# EAGLE schematic F2803x_Layout (EAGLE 6.4)

## Sheet 1 of 2
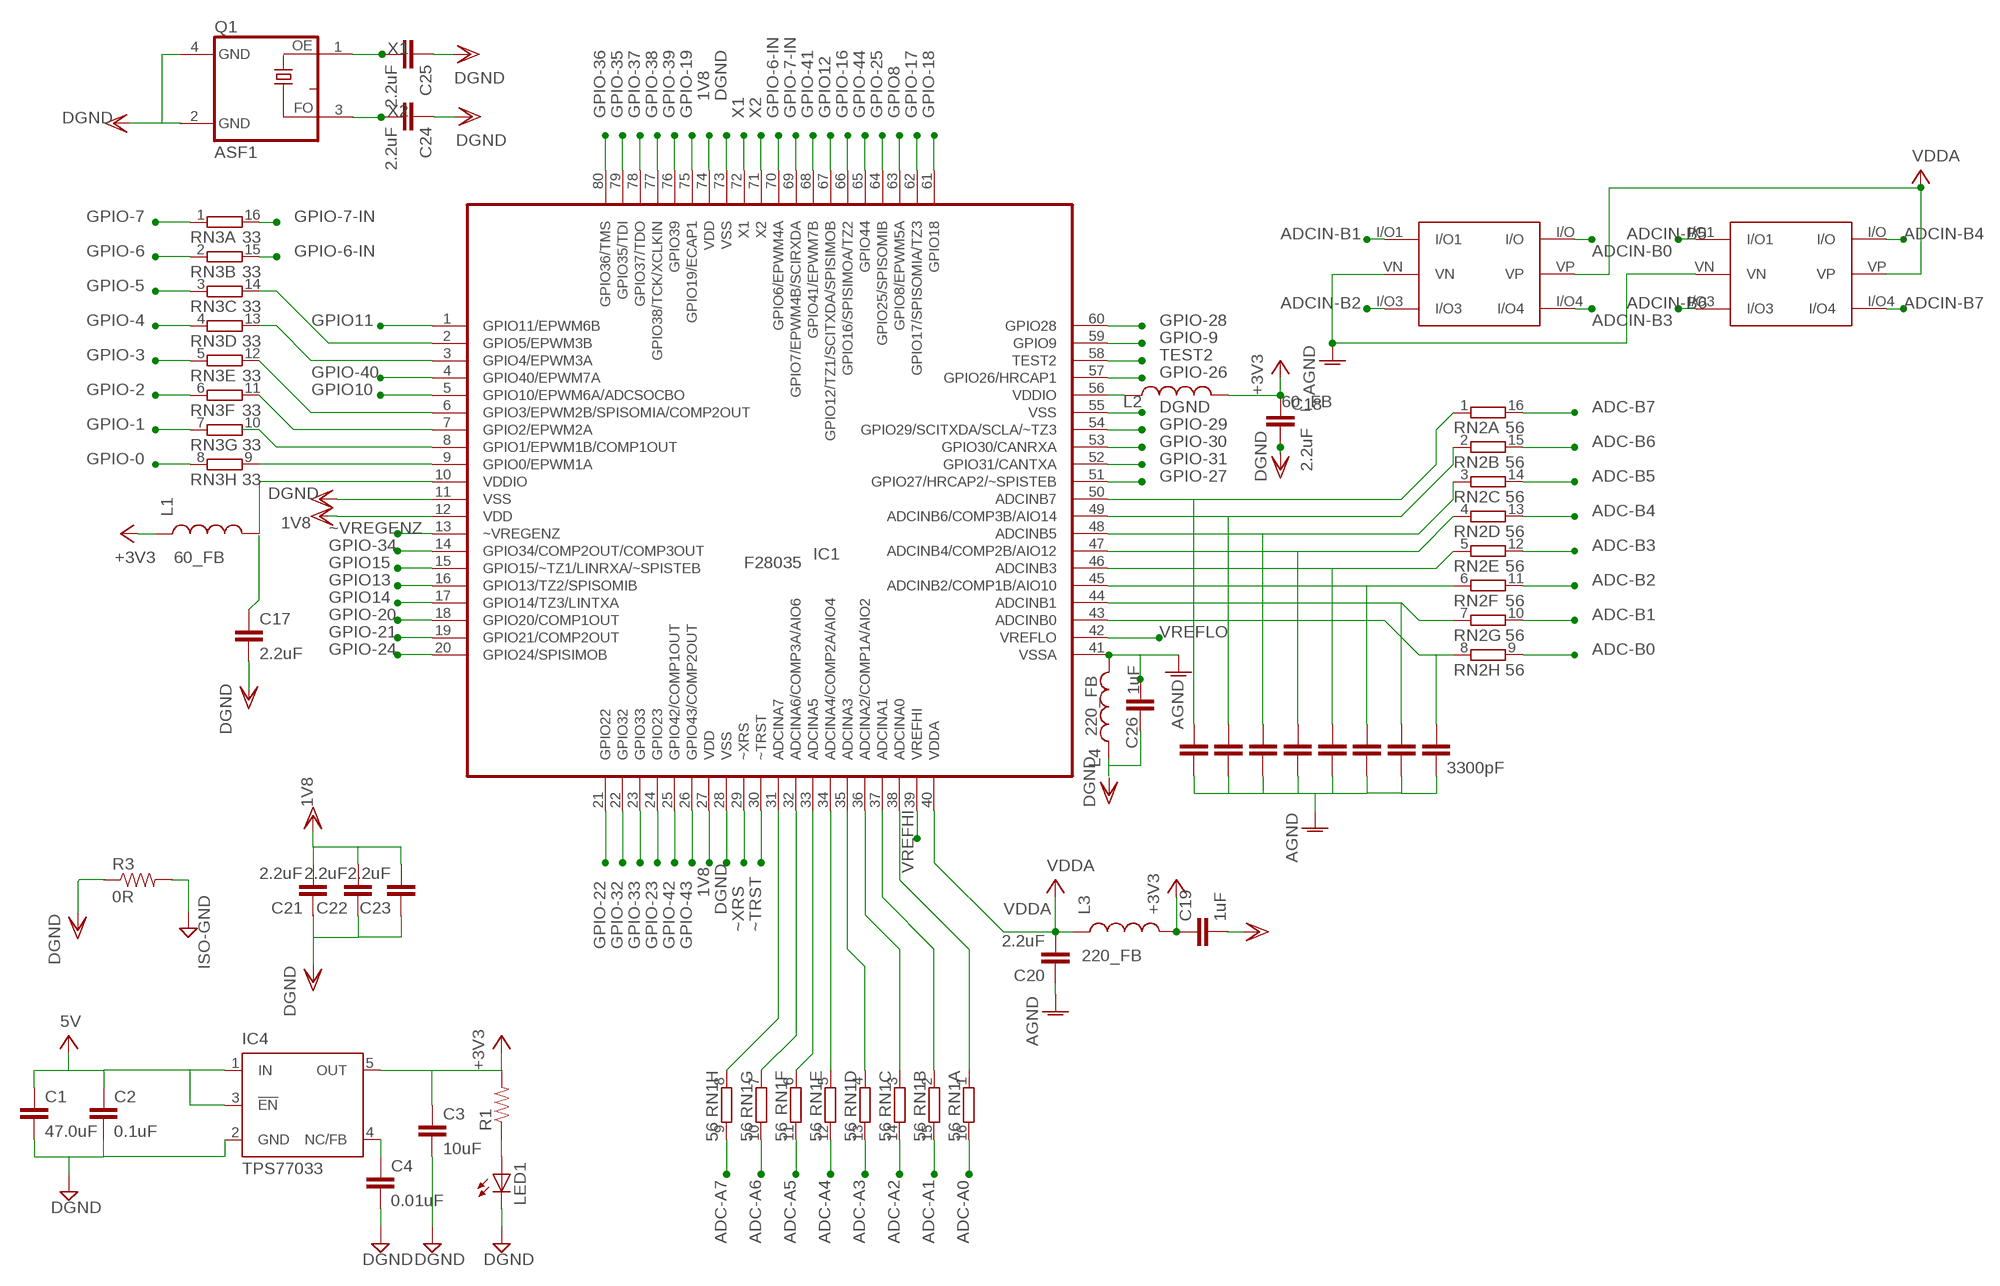
[diagram p0: schematic, sheet 1]

### Parts
C1  47.0uF  1.0UF-25V-+80/-20(0805)  [0805]
C2  0.1uF  0.1UF-25V-5%(0603)  [0603-CAP]
C3  10uF  10UF-6.3V-20%(0603)  [0603-CAP]
C4  0.01uF  0.1UF-25V(+80/-20%)(0603)  [0603-CAP]
C7  10uF  10UF-6.3V-20%(0603)  [0603-CAP]
C10  10uF  10UF-6.3V-20%(0603)  [0603-CAP]
C11  10uF  10UF-6.3V-20%(0603)  [0603-CAP]
C12  10uF  10UF-6.3V-20%(0603)  [0603-CAP]
C13  10uF  10UF-6.3V-20%(0603)  [0603-CAP]
C14  10uF  10UF-6.3V-20%(0603)  [0603-CAP]
C15  10uF  10UF-6.3V-20%(0603)  [0603-CAP]
C16  3300pF  10UF-6.3V-20%(0603)  [0603-CAP]
C17  2.2uF  10UF-6.3V-20%(0603)  [0603-CAP]
C18  2.2uF  10UF-6.3V-20%(0603)  [0603-CAP]
C19  1uF  10UF-6.3V-20%(0603)  [0603-CAP]
C20  2.2uF  10UF-6.3V-20%(0603)  [0603-CAP]
C21  2.2uF  10UF-6.3V-20%(0603)  [0603-CAP]
C22  2.2uF  10UF-6.3V-20%(0603)  [0603-CAP]
C23  2.2uF  10UF-6.3V-20%(0603)  [0603-CAP]
C24  2.2uF  10UF-6.3V-20%(0603)  [0603-CAP]
C25  2.2uF  10UF-6.3V-20%(0603)  [0603-CAP]
C26  1uF  10UF-6.3V-20%(0603)  [0603-CAP]
IC1  F28035  [PN_S-PQFP-G80]
IC4  TPS77033  [SOT23-DBV]
L1  60_FB  INDUCTOR0805  [0805]
L2  60_FB  INDUCTOR0805  [0805]
L3  220_FB  INDUCTOR0805  [0805]
L4  220_FB  INDUCTOR0805  [0805]
LED1  LEDCHIPLED_0603  [CHIPLED_0603]
Q1  ASF1  [ASF]
R1  RESISTOR0603  [0603-RES]
R3  0R  RESISTOR0805-RES  [0805]
RN1  56  8R-NEXB2HV  [EXB2HV]
RN2  56  8R-NEXB2HV  [EXB2HV]
RN3  33  8R-NEXB2HV  [EXB2HV]
U$1  NUP4201MR6  [SOT23-6L]
U$2  NUP4201MR6  [SOT23-6L]

### Nets
1V8: C21.2 C22.2 C23.2 IC1.12(VDD) IC1.27(VDD) IC1.74(VDD)
3V3: C3.1 C18.1 C19.1 IC4.5(OUT) L1.1 L2.2 L3.2 R1.2 ; supply symbol labelled +3V3 ; also sheet 2
5V: C1.1 C2.1 IC4.1(IN) IC4.3(!EN)
ADC-A0: RN1.16
ADC-A1: RN1.15
ADC-A2: RN1.14
ADC-A3: RN1.13
ADC-A4: RN1.12
ADC-A5: RN1.11
ADC-A6: RN1.10
ADC-A7: RN1.9
ADC-B0: RN2.9
ADC-B1: RN2.10
ADC-B2: RN2.11
ADC-B3: RN2.12
ADC-B4: RN2.13
ADC-B5: RN2.14
ADC-B6: RN2.15
ADC-B7: RN2.16
ADCIN-B0: C16.1 IC1.43(ADCINB0) RN2.8 U$1.I/O
ADCIN-B1: C15.1 IC1.44(ADCINB1) RN2.7 U$1.I/O1
ADCIN-B2: C14.1 IC1.45(ADCINB2/COMP1B/AIO10) RN2.6 U$1.I/O3
ADCIN-B3: C13.1 IC1.46(ADCINB3) RN2.5 U$1.I/O4
ADCIN-B4: C12.1 IC1.47(ADCINB4/COMP2B/AIO12) RN2.4 U$2.I/O
ADCIN-B5: C11.1 IC1.48(ADCINB5) RN2.3 U$2.I/O1
ADCIN-B6: C10.1 IC1.49(ADCINB6/COMP3B/AIO14) RN2.2 U$2.I/O3
ADCIN-B7: U$2.I/O4
ADCINB7: C7.1 IC1.50(ADCINB7) RN2.1
AGND: C7.2 C10.2 C11.2 C12.2 C13.2 C14.2 C15.2 C16.2 C20.1 IC1.41(VSSA) L4.2 U$1.VN U$2.VN
DGND: C1.2 C2.2 C3.2 C4.2 C18.2 C22.1 C23.1 C24.1 C25.1 C26.1 IC1.11(VSS) IC1.28(VSS) IC1.55(VSS) IC1.73(VSS) IC4.2(GND) L4.1 LED1.C Q1.4(VCC) ; also sheet 2
GPIO8: IC1.63(GPIO8/EPWM5A)
GPIO10: IC1.5(GPIO10/EPWM6A/ADCSOCBO)
GPIO11: IC1.1(GPIO11/EPWM6B)
GPIO12: IC1.67(GPIO12/TZ1/SCITXDA/SPISIMOB)
GPIO13: IC1.16(GPIO13/TZ2/SPISOMIB)
GPIO14: IC1.17(GPIO14/TZ3/LINTXA)
GPIO15: IC1.15(GPIO15/~TZ1/LINRXA/~SPISTEB)
GPIO-0: RN3.8
GPIO-1: RN3.7
GPIO-2: RN3.6
GPIO-3: RN3.5
GPIO-4: RN3.4
GPIO-5: RN3.3
GPIO-6: RN3.2
GPIO-6-IN: IC1.70(GPIO6/EPWM4A) RN3.15
GPIO-7: RN3.1
GPIO-7-IN: IC1.69(GPIO7/EPWM4B/SCIRXDA) RN3.16
GPIO-9: IC1.59(GPIO9)
GPIO-16: IC1.66(GPIO16/SPISIMOA/TZ2)
GPIO-17: IC1.62(GPIO17/SPISOMIA/TZ3)
GPIO-18: IC1.61(GPIO18)
GPIO-19: IC1.75(GPIO19/ECAP1)
GPIO-20: IC1.18(GPIO20/COMP1OUT)
GPIO-21: IC1.19(GPIO21/COMP2OUT)
GPIO-22: IC1.21(GPIO22)
GPIO-23: IC1.24(GPIO23)
GPIO-24: IC1.20(GPIO24/SPISIMOB)
GPIO-25: IC1.64(GPIO25/SPISOMIB)
GPIO-26: IC1.57(GPIO26/HRCAP1)
GPIO-27: IC1.51(GPIO27/HRCAP2/~SPISTEB)
GPIO-28: IC1.60(GPIO28) ; also sheet 2
GPIO-29: IC1.54(GPIO29/SCITXDA/SCLA/~TZ3) ; also sheet 2
GPIO-30: IC1.53(GPIO30/CANRXA)
GPIO-31: IC1.52(GPIO31/CANTXA) ; also sheet 2
GPIO-32: IC1.22(GPIO32)
GPIO-33: IC1.23(GPIO33)
GPIO-34: IC1.14(GPIO34/COMP2OUT/COMP3OUT) ; also sheet 2
GPIO-35: IC1.79(GPIO35/TDI)
GPIO-36: IC1.80(GPIO36/TMS)
GPIO-37: IC1.78(GPIO37/TDO)
GPIO-38: IC1.77(GPIO38/TCK/XCLKIN)
GPIO-39: IC1.76(GPIO39)
GPIO-40: IC1.4(GPIO40/EPWM7A)
GPIO-41: IC1.68(GPIO41/EPWM7B)
GPIO-42: IC1.25(GPIO42/COMP1OUT)
GPIO-43: IC1.26(GPIO43/COMP2OUT)
GPIO-44: IC1.65(GPIO44)
N$1: C17.1
N$3: C26.2
N$9: IC1.38(ADCINA0) RN1.1
N$10: IC1.37(ADCINA1) RN1.2
N$11: IC1.36(ADCINA2/COMP1A/AIO2) RN1.3
N$12: IC1.35(ADCINA3) RN1.4
N$13: IC1.34(ADCINA4/COMP2A/AIO4) RN1.5
N$14: IC1.33(ADCINA5) RN1.6
N$15: IC1.32(ADCINA6/COMP3A/AIO6) RN1.7
N$16: IC1.31(ADCINA7) RN1.8
N$17: IC1.9(GPIO0/EPWM1A) RN3.9
N$18: IC1.8(GPIO1/EPWM1B/COMP1OUT)
N$19: IC1.7(GPIO2/EPWM2A) RN3.11
N$20: IC1.6(GPIO3/EPWM2B/SPISOMIA/COMP2OUT) RN3.12
N$21: IC1.3(GPIO4/EPWM3A) RN3.13
N$22: IC1.2(GPIO5/EPWM3B) RN3.14
N$23: IC1.56(VDDIO) L2.1
N$25: IC1.10(VDDIO) L1.2
N$28: LED1.A R1.1
N$30: C4.1 IC4.4(NC/FB)
TEST2: IC1.58(TEST2)
VDDA: C20.2 IC1.40(VDDA) L3.1 U$1.VP U$2.VP ; also sheet 2
VREFHI: IC1.39(VREFHI) ; also sheet 2
VREFLO: IC1.42(VREFLO) ; also sheet 2
X1: C25.2 IC1.72(X1) Q1.1(OE)
X2: IC1.71(X2)
~TRST: IC1.30(~TRST)
~VREGENZ: IC1.13(~VREGENZ)
~XRS: IC1.29(~XRS)
Unconnected: C17.2 C19.2 C21.1 C24.2 Q1.3(FO) R3.1 R3.2 RN3.10

## Sheet 2 of 2
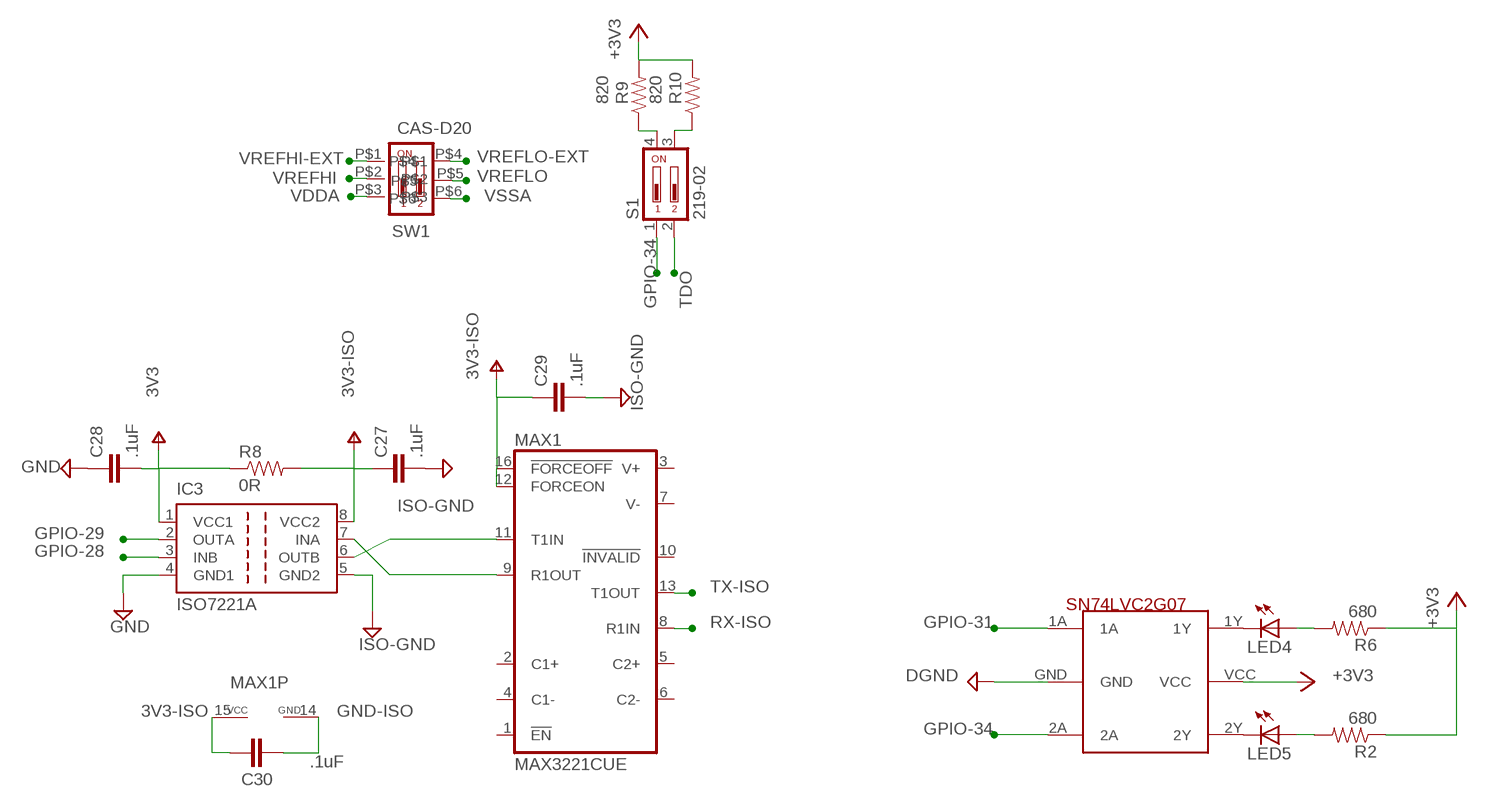
[diagram p1: schematic, sheet 2]

### Parts
C27  .1uF  10UF-6.3V-20%(0603)  [0603-CAP]
C28  .1uF  10UF-6.3V-20%(0603)  [0603-CAP]
C29  .1uF  10UF-6.3V-20%(0603)  [0603-CAP]
C30  .1uF  10UF-6.3V-20%(0603)  [0603-CAP]
IC3  ISO7221A  [SO-08]
LED4  LEDCHIPLED_0603  [CHIPLED_0603]
LED5  LEDCHIPLED_0603  [CHIPLED_0603]
MAX1  MAX3221CUE  [TSSOP16]
R2  680  RESISTOR0603  [0603-RES]
R6  680  RESISTOR0603  [0603-RES]
R8  0R  RESISTOR0805-RES  [0805]
R9  820  RESISTOR0603  [0603-RES]
R10  820  RESISTOR0603  [0603-RES]
S1  219-02  [CTS-219-02]
SW1  CAS-D20  [CAS-D20]
U$4  SN74LVC2G07  [SOT23-6L]

### Nets
3V3: C28.2 IC3.1(VCC1) R8.1 U$4.VCC ; supply symbol labelled V+, +3V3 ; also sheet 1
3V3-ISO: C27.1 C29.1 C30.1 IC3.8(VCC2) MAX1.12(FORCEON) MAX1.15(VCC) MAX1.16(!FORCEOFF) R8.2 ; supply symbol labelled V+
+3V3: R2.1 R6.1 R9.2 R10.2
DGND: U$4.GND ; supply symbol labelled GND ; also sheet 1
GND: C27.2 C28.1 C29.2 IC3.4(GND1) ; supply symbol labelled ISO-GND
GND-ISO: C30.2 MAX1.14(GND)
GPIO-28: IC3.3(INB) ; also sheet 1
GPIO-29: IC3.2(OUTA) ; also sheet 1
GPIO-31: U$4.1A ; also sheet 1
GPIO-34: S1.1 U$4.2A ; also sheet 1
ISO-GND: IC3.5(GND2) ; also sheet 1
N$4: IC3.7(INA) MAX1.9(R1OUT)
N$5: IC3.6(OUTB) MAX1.11(T1IN)
N$6: R9.1 S1.4
N$7: R10.1 S1.3
N$8: LED4.C U$4.1Y
N$24: LED5.C U$4.2Y
N$26: LED4.A R6.2
N$33: LED5.A R2.2
RX-ISO: MAX1.8(R1IN)
TDO: S1.2
TX-ISO: MAX1.13(T1OUT)
VDDA: SW1.P$3 ; also sheet 1
VREFHI: SW1.P$2 ; also sheet 1
VREFHI-EXT: SW1.P$1
VREFLO: SW1.P$5 ; also sheet 1
VREFLO-EXT: SW1.P$4
VSSA: SW1.P$6
Unconnected: MAX1.1(!EN) MAX1.2(C1+) MAX1.3(V+) MAX1.4(C1-) MAX1.5(C2+) MAX1.6(C2-) MAX1.7(V-) MAX1.10(!INVALID)

## Power pins joined to a net without a drawn wire
ISO-GND: Q1.2(GND)

## Library data of the parts
C1 = SparkFun-Capacitors:1.0UF-25V-+80/-20(0805): CAP-11625; PROD_ID: CAP-11625; VALUE: 1.0uF
C2 = SparkFun-Capacitors:0.1UF-25V-5%(0603): CAP-08604; PROD_ID: CAP-08604
C3 C7 C10-C15 = SparkFun-Capacitors:10UF-6.3V-20%(0603): CAP-11015; PROD_ID: CAP-11015
C4 = SparkFun-Capacitors:0.1UF-25V(+80/-20%)(0603): CAP-00810 Ceramic Standard decoupling cap; PROD_ID: CAP-00810; VALUE: 0.1uF
C16-C30 = SparkFun-Capacitors:10UF-6.3V-20%(0603): CAP-11015; PROD_ID: CAP-11015; VALUE: 10uF
IC1 = texas:F28035: MIXED SIGNAL MICROCONTROLLER Auto generated by make-symbol-device-package-bsdl.ulp Rev. 29 Source: http://focus.ti.com/lit/ds/symlink/msp430fg437.pdf; OC_FARNELL: 1471275; OC_NEWARK: 61M7844
IC3 = texas:ISO7221: DUAL DIGITAL ISOLATORS Source: http://focus.ti.com/lit/ds/symlink/iso7221a.pdf; MPN: ISO7221AD; OC_FARNELL: 1390651; OC_NEWARK: 48M0672
IC4 = texas:TPS770*: ULTRALOW-POWER 50-mA LOW-DROPOUT LINEAR REGULATORS 50-mA Low-Dropout Regulator Source: http://focus.ti.com/lit/ds/symlink/tps77001.pdf; MF: TEXAS INSTRUMENTS; MPN: TPS77033DBVT; OC_FARNELL: 8461570; OC_NEWARK: 77C1187
L1-L4 = SparkFun-Passives:INDUCTOR: Inductors Basic Inductor/Choke - 0603 and 1206. Footprints are not proven and vary greatly between part numbers. SRN6045- 33uH, 20% 1.4A SDR0403-560KL - 56uH, 10%, 500mA RMS/740mA peak
LED1 LED4 LED5 = led:LED: LED OSRAM: - CHIPLED LG R971, LG N971, LY N971, LG Q971, LY Q971, LO R971, LY R971 LH N974, LH R974 LS Q976, LO Q976, LY Q976 LO Q996 - Hyper CHIPLED LW Q18S LB Q993, LB Q99A, LB R99A - SideLED LS A670, LO A670, LY A670, LG A670, LP A670 LB A673, LV A673, LT A673, LW A673 LH A674 LY A675 LS A676, LA A676, LO A676, LY A676, LW A676 LS A679, LY A679, LG A679 - Hyper Micro SIDELED® LS Y876, LA Y876, LO Y876, LY Y876 LT Y87S - SmartLED LW L88C, LW L88S LB L89C, LB L89S, LG L890 LS L89K, LO L89K, LY L89K LS L896, LA L896, LO L896, LY L896 - TOPLED LS T670, LO T670, LY T670, LG T670, LP T670 LSG T670, LSP T670, LSY T670, LOP T670, LYG T670 LG T671, LOG T671, LSG T671 LB T673, LV T673, LT T673, LW T673 LH T674 LS T676, LA T676, LO T676, LY T676, LB T676, LH T676, LSB T676, LW T676 LB T67C, LV T67C, LT T67C, LS T67K, LO T67K, LY T67K, LW E67C LS E67B, LA E67B, LO E67B, LY E67B, LB E67C, LV E67C, LT E67C LW T67C LS T679, LY T679, LG T679 LS T770, LO T770, LY T770, LG T770, LP T770 LB T773, LV T773, LT T773, LW T773 LH T774 LS E675, LA E675, LY E675, LS T675 LS T776, LA T776, LO T776, LY T776, LB T776 LHGB T686 LT T68C, LB T68C - Hyper Mini TOPLED® LB M676 - Mini TOPLED Santana® LG M470 LS M47K, LO M47K, LY M47K Source: http://www.osram.convergy.de LUXEON: - LUMILED® LXK2-PW12-R00, LXK2-PW12-S00, LXK2-PW14-U00, LXK2-PW14-V00 LXK2-PM12-R00, LXK2-PM12-S00, LXK2-PM14-U00 LXK2-PE12-Q00, LXK2-PE12-R00, LXK2-PE12-S00, LXK2-PE14-T00, LXK2-PE14-U00 LXK2-PB12-K00, LXK2-PB12-L00, LXK2-PB12-M00, LXK2-PB14-N00, LXK2-PB14-P00, LXK2-PB14-Q00 LXK2-PR12-L00, LXK2-PR12-M00, LXK2-PR14-Q00, LXK2-PR14-R00 LXK2-PD12-Q00, LXK2-PD12-R00, LXK2-PD12-S00 LXK2-PH12-R00, LXK2-PH12-S00 LXK2-PL12-P00, LXK2-PL12-Q00, LXK2-PL12-R00 Source: www.luxeon.com KINGBRIGHT: KA-3528ASYC Source: www.kingbright.com
MAX1 = maxim1:MAX3221*: RS-232 Transceivers with AutoShutdown 1µA Supply-Current, True +3V to +5.5V http://dbserv.maxim-ic.com/
Q1 = crystal:ASF*: CRYSTAL CLOCK OSCILLATORS 5.0 Vdc or 3.3 Vdc - LOW PROFILE ULTRA MINIATURE CERAMIC SURFACE MOUNT Source: http://www.abracon.com/Oscillators/asf1-L-L1.pdf; OC_FARNELL: unknown; OC_NEWARK: unknown
R1 R2 R6 R9 R10 = SparkFun-Resistors:RESISTOR: Resistor Basic schematic elements and footprints for 0603, 1206, and PTH resistors.
R3 R8 = SparkFun-Passives:RESISTOR: Resistor Basic schematic elements and footprints for 0603, 1206, and PTH resistors.
RN1-RN3 = resistor-dil:8R-N: DIL RESISTOR; OC_FARNELL: unknown; OC_NEWARK: unknown
S1 = switch-dil:219-02*: Surface Mount DIP Switch Series 219 SMT CTS Electronic Components Sourc: www.ctscorp.com; OC_FARNELL: unknown; OC_NEWARK: unknown
SW1 = switch:CAS-D20
U$1 U$2 = on-semiconductor:NUP4201MR6
U$4 = texas:SN74LVC2G07